# Altium project Magneto_Coils_RevA.PrjPcb
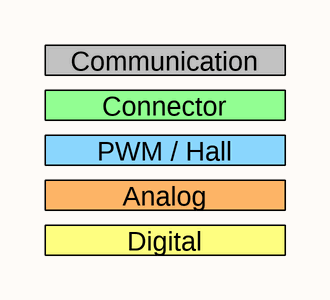
[diagram p0: Coil Board - Cover.SchDoc]
3 sheets, 140 parts. Net scope: hierarchical (ports join the sheet entries above them; power ports are global).
Board file: Coil Board.PcbDoc
Sheets:
  Coil Board - Cover.SchDoc
  Coil Board - Heirarchy.SchDoc
    Coil Row = Coil Board - Planar_Coils.SchDoc
    Coil Row = Coil Board - Planar_Coils.SchDoc
    Coil Row = Coil Board - Planar_Coils.SchDoc
    Coil Row = Coil Board - Planar_Coils.SchDoc
    Coil Row = Coil Board - Planar_Coils.SchDoc
    Coil Row = Coil Board - Planar_Coils.SchDoc
    Coil Row = Coil Board - Planar_Coils.SchDoc
    Coil Row = Coil Board - Planar_Coils.SchDoc
    Coil Row = Coil Board - Planar_Coils.SchDoc
    Coil Row = Coil Board - Planar_Coils.SchDoc

## Sheet Coil Board - Cover.SchDoc
size B

### Notes on the sheet
- Connector
- Communication
- PWM / Hall
- Analog
- Digital
- Title
- Size:
- Date:
- B
- Number:
- Time:
- Revision:
- Sheet
- of
- File:

## Sheet Coil Board - Heirarchy.SchDoc: Heirarchy
size B
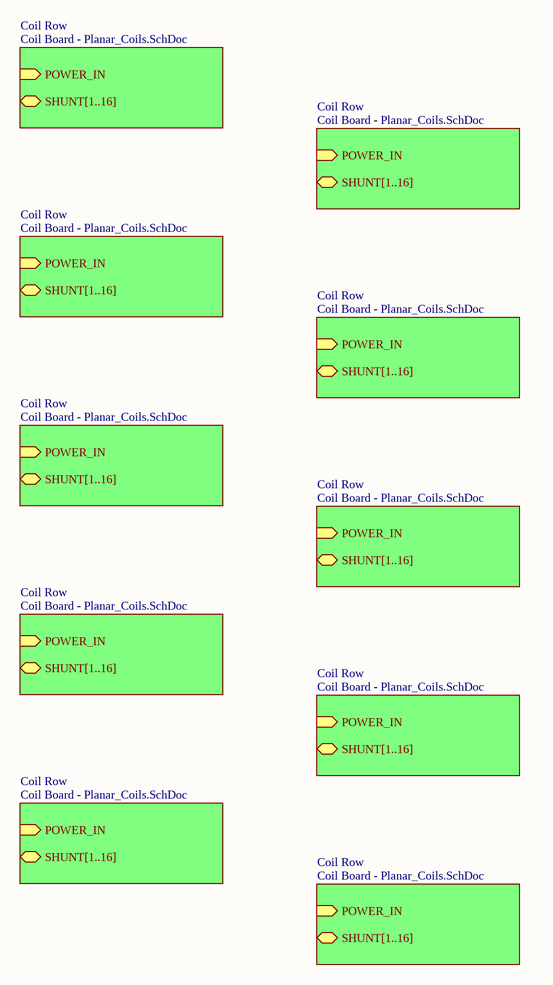
[diagram p1: Coil Board - Heirarchy.SchDoc]

### Sub-sheets
Coil Row = Coil Board - Planar_Coils.SchDoc: SHUNT[1..16] (bidir), POWER_IN (in)
Coil Row = Coil Board - Planar_Coils.SchDoc: SHUNT[1..16] (bidir), POWER_IN (in)
Coil Row = Coil Board - Planar_Coils.SchDoc: SHUNT[1..16] (bidir), POWER_IN (in)
Coil Row = Coil Board - Planar_Coils.SchDoc: SHUNT[1..16] (bidir), POWER_IN (in)
Coil Row = Coil Board - Planar_Coils.SchDoc: SHUNT[1..16] (bidir), POWER_IN (in)
Coil Row = Coil Board - Planar_Coils.SchDoc: SHUNT[1..16] (bidir), POWER_IN (in)
Coil Row = Coil Board - Planar_Coils.SchDoc: SHUNT[1..16] (bidir), POWER_IN (in)
Coil Row = Coil Board - Planar_Coils.SchDoc: SHUNT[1..16] (bidir), POWER_IN (in)
Coil Row = Coil Board - Planar_Coils.SchDoc: SHUNT[1..16] (bidir), POWER_IN (in)
Coil Row = Coil Board - Planar_Coils.SchDoc: SHUNT[1..16] (bidir), POWER_IN (in)

### Notes on the sheet
- Title
- Size:
- Date:
- B
- Number:
- Time:
- Revision:
- Sheet
- of
- File:

## Sheet Coil Board - Planar_Coils.SchDoc: Planar Coil Row
size B
Used 10 times, as channels Coil Row, Coil Row, Coil Row, Coil Row, Coil Row, Coil Row, Coil Row, Coil Row, Coil Row, Coil Row. Parts and nets are listed once, with the designators drawn on the sheet.
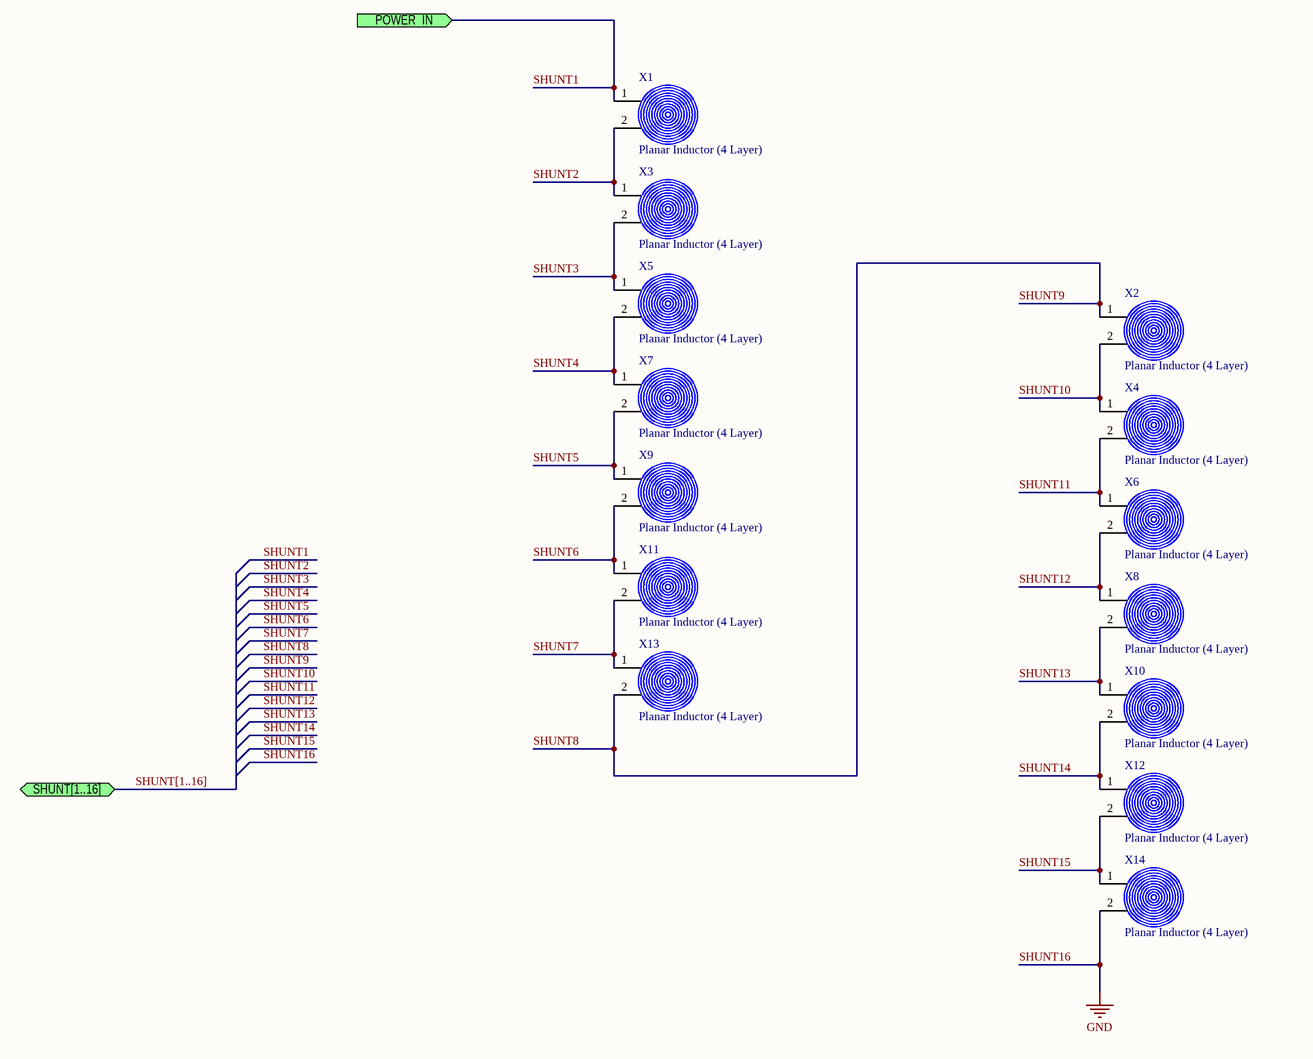
[diagram p2: Coil Board - Planar_Coils.SchDoc]

### Parts
X1  Planar Inductor (4 Layer)  [Planar Coil - 44 Turns (12.5mm)]  (no BOM)
X2  Planar Inductor (4 Layer)  [Planar Coil - 44 Turns (12.5mm)]  (no BOM)
X3  Planar Inductor (4 Layer)  [Planar Coil - 44 Turns (12.5mm)]  (no BOM)
X4  Planar Inductor (4 Layer)  [Planar Coil - 44 Turns (12.5mm)]  (no BOM)
X5  Planar Inductor (4 Layer)  [Planar Coil - 44 Turns (12.5mm)]  (no BOM)
X6  Planar Inductor (4 Layer)  [Planar Coil - 44 Turns (12.5mm)]  (no BOM)
X7  Planar Inductor (4 Layer)  [Planar Coil - 44 Turns (12.5mm)]  (no BOM)
X8  Planar Inductor (4 Layer)  [Planar Coil - 44 Turns (12.5mm)]  (no BOM)
X9  Planar Inductor (4 Layer)  [Planar Coil - 44 Turns (12.5mm)]  (no BOM)
X10  Planar Inductor (4 Layer)  [Planar Coil - 44 Turns (12.5mm)]  (no BOM)
X11  Planar Inductor (4 Layer)  [Planar Coil - 44 Turns (12.5mm)]  (no BOM)
X12  Planar Inductor (4 Layer)  [Planar Coil - 44 Turns (12.5mm)]  (no BOM)
X13  Planar Inductor (4 Layer)  [Planar Coil - 44 Turns (12.5mm)]  (no BOM)
X14  Planar Inductor (4 Layer)  [Planar Coil - 44 Turns (12.5mm)]  (no BOM)

### Ports
POWER_IN (in), SHUNT[1..16] (bidir)

### Nets
SHUNT16: X14.2  [also labelled GND]
SHUNT1: X1.1 ; port POWER_IN
SHUNT2: X1.2 X3.1
SHUNT3: X3.2 X5.1
SHUNT4: X5.2 X7.1
SHUNT5: X7.2 X9.1
SHUNT6: X9.2 X11.1
SHUNT7: X11.2 X13.1
SHUNT8: X2.1 X13.2  [also labelled SHUNT9]
SHUNT10: X2.2 X4.1
SHUNT11: X4.2 X6.1
SHUNT12: X6.2 X8.1
SHUNT13: X8.2 X10.1
SHUNT14: X10.2 X12.1
SHUNT15: X12.2 X14.1

### Channels
Coil Row: designators end in _Coil_Row#1; ports POWER_IN=SHUNT1_Coil Row
Coil Row: designators end in _Coil_Row#2; ports POWER_IN=SHUNT1_Coil Row
Coil Row: designators end in _Coil_Row#3; ports POWER_IN=SHUNT1_Coil Row
Coil Row: designators end in _Coil_Row#4; ports POWER_IN=SHUNT1_Coil Row
Coil Row: designators end in _Coil_Row#5; ports POWER_IN=SHUNT1_Coil Row
Coil Row: designators end in _Coil_Row#6; ports POWER_IN=SHUNT1_Coil Row
Coil Row: designators end in _Coil_Row#7; ports POWER_IN=SHUNT1_Coil Row
Coil Row: designators end in _Coil_Row#8; ports POWER_IN=SHUNT1_Coil Row
Coil Row: designators end in _Coil_Row#9; ports POWER_IN=SHUNT1_Coil Row
Coil Row: designators end in _Coil_Row#10; ports POWER_IN=SHUNT1_Coil Row

### Buses and harness runs
bus SHUNT[1..16] = port SHUNT[1..16]

### Notes on the sheet
- Title
- Size:
- Date:
- B
- Number:
- Time:
- Revision:
- Sheet
- of
- File:

### Library data of the parts
X1-X14 = Planar Coil - 44 Turns, 12mm: Resistance: 1.11ohm; Inductance: 2.44uH; Layers: 4

## Nets that join several sheets
SHUNT16: Coil Row (X14_Coil_Row#1.2), Coil Row (X14_Coil_Row#2.2), Coil Row (X14_Coil_Row#3.2), Coil Row (X14_Coil_Row#4.2), Coil Row (X14_Coil_Row#5.2), Coil Row (X14_Coil_Row#6.2), Coil Row (X14_Coil_Row#7.2), Coil Row (X14_Coil_Row#8.2), Coil Row (X14_Coil_Row#9.2), Coil Row (X14_Coil_Row#10.2)